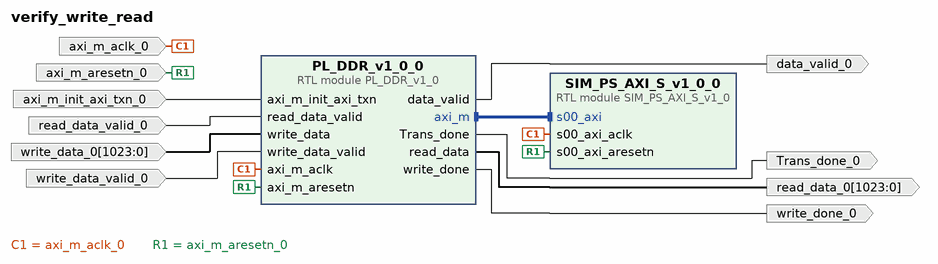
[diagram p0: block diagram of the top level]
# Vivado block design verify_write_read, xczu7ev-ffvc1156-2-e, Vivado 2021.2
create_bd_design verify_write_read

create_bd_port -dir I axi_m_init_axi_txn_0
create_bd_port -dir I -type clk axi_m_aclk_0
create_bd_port -dir I -type rst axi_m_aresetn_0
create_bd_port -dir I write_data_valid_0
create_bd_port -dir I -from 1023 -to 0 write_data_0
create_bd_port -dir I read_data_valid_0
create_bd_port -dir O -from 1023 -to 0 read_data_0
create_bd_port -dir O data_valid_0
create_bd_port -dir O Trans_done_0
create_bd_port -dir O write_done_0

create_bd_cell -type module -reference SIM_PS_AXI_S_v1_0 SIM_PS_AXI_S_v1_0_0
set_property -dict {CONFIG.C_S00_AXI_ADDR_WIDTH 30 CONFIG.C_S00_AXI_DATA_WIDTH 128} [get_bd_cells SIM_PS_AXI_S_v1_0_0]
create_bd_cell -type module -reference PL_DDR_v1_0 PL_DDR_v1_0_0
set_property -dict {CONFIG.C_AXI_M_BURST_LEN 8 CONFIG.C_AXI_M_DATA_WIDTH 128} [get_bd_cells PL_DDR_v1_0_0]

# ---- connections ----

connect_bd_intf_net [get_bd_intf_pins PL_DDR_v1_0_0/axi_m] [get_bd_intf_pins SIM_PS_AXI_S_v1_0_0/s00_axi]
connect_bd_net [get_bd_pins PL_DDR_v1_0_0/Trans_done] [get_bd_ports Trans_done_0]
connect_bd_net [get_bd_pins PL_DDR_v1_0_0/data_valid] [get_bd_ports data_valid_0]
connect_bd_net [get_bd_pins PL_DDR_v1_0_0/read_data] [get_bd_ports read_data_0]
connect_bd_net [get_bd_pins PL_DDR_v1_0_0/write_done] [get_bd_ports write_done_0]
connect_bd_net -net axi_m_aclk_0_1 [get_bd_ports axi_m_aclk_0] [get_bd_pins SIM_PS_AXI_S_v1_0_0/s00_axi_aclk] [get_bd_pins PL_DDR_v1_0_0/axi_m_aclk]
connect_bd_net -net axi_m_aresetn_0_1 [get_bd_ports axi_m_aresetn_0] \
  [get_bd_pins SIM_PS_AXI_S_v1_0_0/s00_axi_aresetn] [get_bd_pins PL_DDR_v1_0_0/axi_m_aresetn]
connect_bd_net -net axi_m_init_axi_txn_0_1 [get_bd_ports axi_m_init_axi_txn_0] [get_bd_pins PL_DDR_v1_0_0/axi_m_init_axi_txn]
connect_bd_net -net read_data_valid_0_1 [get_bd_ports read_data_valid_0] [get_bd_pins PL_DDR_v1_0_0/read_data_valid]
connect_bd_net -net write_data_0_1 [get_bd_ports write_data_0] [get_bd_pins PL_DDR_v1_0_0/write_data]
connect_bd_net -net write_data_valid_0_1 [get_bd_ports write_data_valid_0] [get_bd_pins PL_DDR_v1_0_0/write_data_valid]

# ---- address map ----
assign_bd_address -offset 0x44A00000 -range 64K -target_address_space [get_bd_addr_spaces PL_DDR_v1_0_0/axi_m] [get_bd_addr_segs SIM_PS_AXI_S_v1_0_0/s00_axi/reg0]

validate_bd_design
save_bd_design
